# Altium schematic sheet STLink_Schematic.SchDoc
size A3; DocumentNumber: 1; Revision: V1.0; SheetNumber: 1; SheetTotal: 1
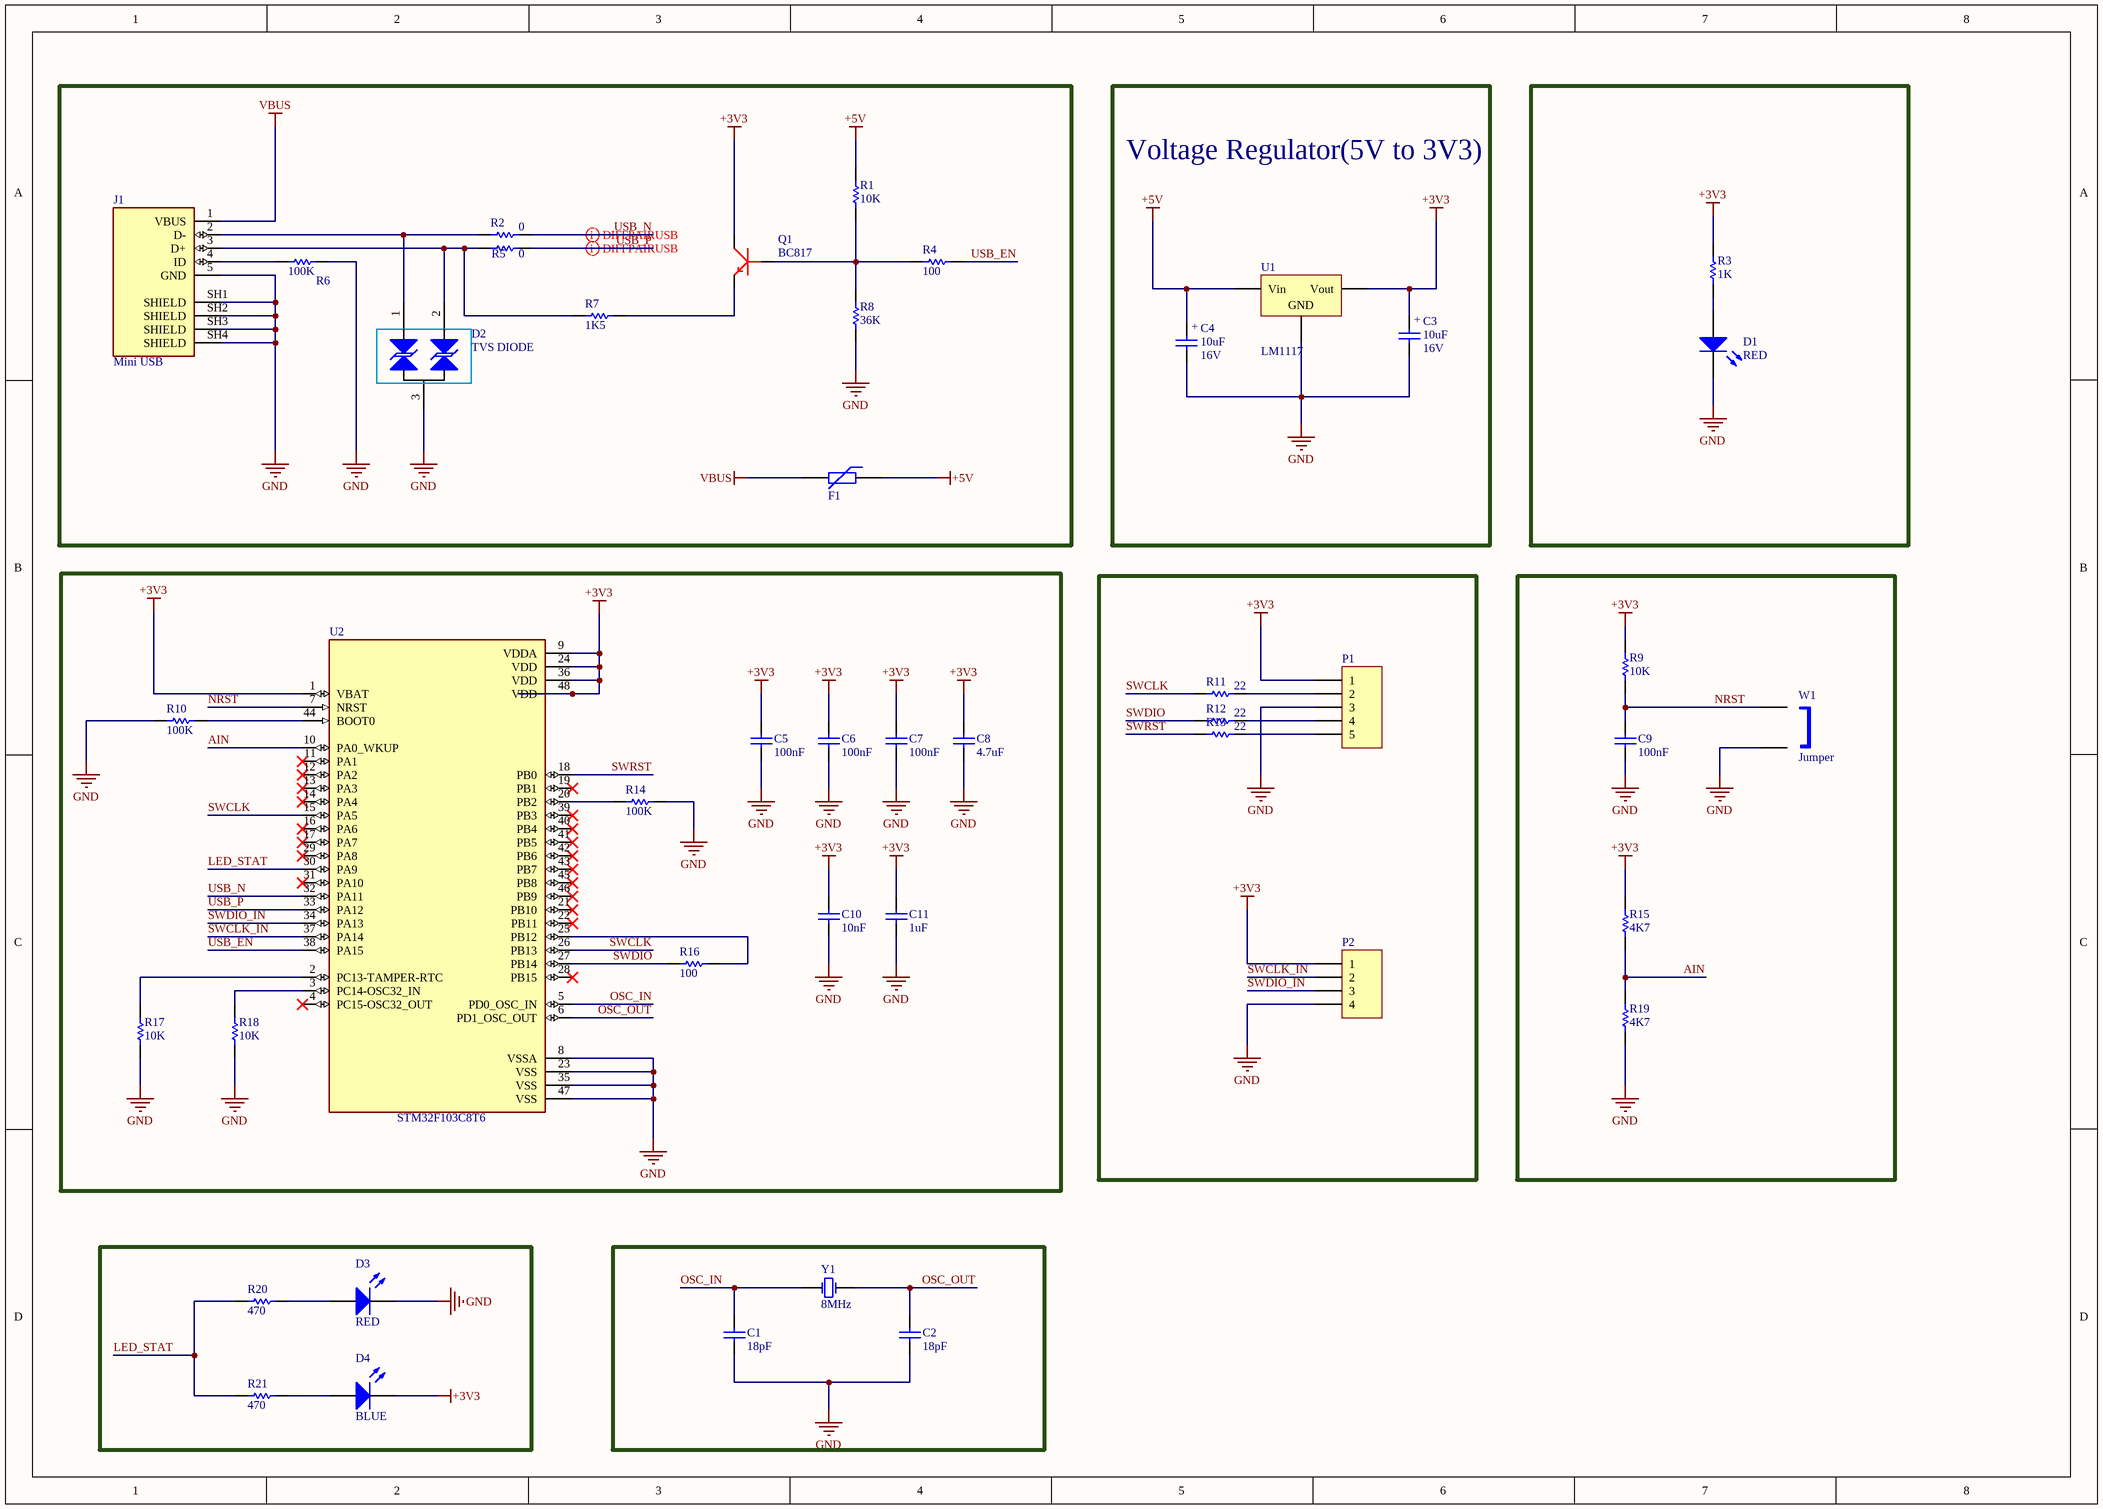
[diagram p0: STLink_Schematic.SchDoc]

## Parts
C1  18pF  [C805]
C2  18pF  [C805]
C3  Volte: 16V  [MY_SMC_B]  (hidden comment: 10uF)
C4  Volte: 16V  [MY_SMC_B]  (hidden comment: 10uF)
C5  100nF  [C805]
C6  100nF  [C805]
C7  100nF  [C805]
C8  4.7uF  [C805]
C9  100nF  [C805]
C10  10nF  [C805]
C11  1uF  [C805]
D1  RED  [MY_LED_1206]
D2  TVS DIODE  [SOT-23]
D3  RED  [MY_LED_0805]
D4  BLUE  [MY_LED_0805]
F1  (no value)  [PTC-0805]
J1  Mini USB  [MiniUSB]
P1  Header 5  [My_1X05]  (value not drawn)
P2  Header 4  [My_1X04]  (value not drawn)
Q1  BC817  [SOT23_3]
R1  10K  [R805]
R2  0  [R805]
R3  1K  [R805]
R4  100  [R805]
R5  0  [R805]
R6  100K  [R805]
R7  1K5  [R805]
R8  36K  [R805]
R9  10K  [R805]
R10  100K  [R805]
R11  22  [R805]
R12  22  [R805]
R13  22  [R805]
R14  100K  [R805]
R15  4K7  [R805]
R16  100  [R805]
R17  10K  [R805]
R18  10K  [R805]
R19  4K7  [R805]
R20  470  [R805]
R21  470  [R805]
U1  LM1117  [MY_SOT223]
U2  STM32F103C8T6  [QFP50P900X900X160-48N]
W1  Jumper  [My_1X02]
Y1  8MHz  [XTAL-SMD]

## Blocks framed on the sheet
Voltage Regulator(5V to 3V3): C3 C4 U1

## Nets
+3V3: C3.+ C5.2 C6.2 C7.2 C8.2 C10.2 C11.2 D4.K P1.1 P2.1 Q1.3(C) R3.2 R9.1 R15.1 U1.2(Vout) U2.1(VBAT) U2.9(VDDA) U2.24(VDD) U2.36(VDD) U2.48(VDD)
+5V: C4.+ F1.1 R1.2 U1.3(Vin)
GND: C1.1 C2.1 C3.- C4.- C5.1 C6.1 C7.1 C8.1 C9.1 C10.1 C11.1 D1.K D2.3(A) D3.K J1.5(GND) J1.SH1(SHIELD) J1.SH2(SHIELD) J1.SH3(SHIELD) J1.SH4(SHIELD) P1.3 P2.4 R6.2 R8.1 R10.2 R14.1 R17.2 R18.2 R19.2 U1.1(GND) U2.8(VSSA) U2.23(VSS) U2.35(VSS) U2.47(VSS) W1.2
VBUS: F1.2 J1.1(VBUS)
AIN: R15.2 R19.1 U2.10(PA0_WKUP)
LED_STAT: R20.2 R21.2 U2.30(PA9)
NRST: C9.2 R9.2 U2.7(NRST) W1.1
OSC_IN: C1.2 U2.5(PD0_OSC_IN) Y1.1(OSC1)
OSC_OUT: C2.2 U2.6(PD1_OSC_OUT) Y1.2(OSC2)
SWCLK: R11.2 U2.15(PA5) U2.26(PB13)
SWCLK_IN: P2.2 U2.37(PA14)
SWDIO: R12.2 R16.2 U2.27(PB14)
SWDIO_IN: P2.3 U2.34(PA13)
SWRST: R13.2 U2.18(PB0)
USB_EN: R4.1 U2.38(PA15)
USB_N: R2.2 U2.32(PA11)
USB_P: R5.2 U2.33(PA12)
NetD1_A: D1.A R3.1
NetD2_1: D2.1(K) J1.2(D-) R2.1
NetD2_2: D2.2(K) J1.3(D+) R5.1 R7.1
NetD3_A: D3.A R20.1
NetD4_A: D4.A R21.1
NetJ1_4: J1.4(ID) R6.1
NetP1_2: P1.2 R11.1
NetP1_4: P1.4 R12.1
NetP1_5: P1.5 R13.1
NetQ1_1: Q1.1(B) R1.1 R4.2 R8.2
NetQ1_2: Q1.2(E) R7.2
NetR10_1: R10.1 U2.44(BOOT0)
NetR14_2: R14.2 U2.20(PB2)
NetR16_1: R16.1 U2.25(PB12)
NetR17_1: R17.1 U2.2(PC13-TAMPER-RTC)
NetR18_1: R18.1 U2.3(PC14-OSC32_IN)

Not connected (* = marked no-connect by the designer): U2 4(PC15-OSC32_OUT)* 11(PA1)* 12(PA2)* 13(PA3)* 14(PA4)* 16(PA6)* 17(PA7)* 19(PB1)* 21(PB10)* 22(PB11)* 28(PB15)* 29(PA8)* 31(PA10)* 39(PB3)* 40(PB4)* 41(PB5)* 42(PB6)* 43(PB7)* 45(PB8)* 46(PB9)*

## Layout directives
differential pair; differential pair class DiffPairUSB: USB_N, USB_P

## Library data of the parts
C1 C2 C5-C11 = Cap: Capacitor; Designer: Parsa Malekpour
  C1 C2: Value: 18pF
  C5-C7 C9: Value: 100nF
  C8: Value: 4.7uF
  C10: Value: 10nF
  C11: Value: 1uF
C3 C4 = Cap Pol: Polar capacitor; ASiD Part Number: C-AS; Value: 10uF
D1 D3 D4 = LED: Typical INFRARED GaAs LED; ASiD Part Number: LED-AS
D2 = SM712
F1 = PTC: Published: 24-Mar-1999; PackageVersion: Mar-2003; PackageReference: 6-0805
J1 = Mini USB: MINI USB 2.0- B Type Receptacle conn. Right Angle Surface Mount Type; MF: Amphenol ICC; MP: 10033526-N3212LF; SnapEDA_Link: https://www.snapeda.com/parts/10033526-N3212LF/Amphenol+FCI/view-part/?ref=snap; Package: None; Value: *; Check_prices: https://www.snapeda.com/parts/10033526-N3212LF/Amphenol+FCI/view-part/?ref=eda
P1 = Header 5: Header, 5-Pin; ASiD Part Number: Header 5-AS
P2 = Header 4: Header, 4-Pin; ASiD Part Number: Header 4-AS
Q1 = bc817-16
R1-R21 = Resistor: Designer: Parsa Malekpour
  R1 R9 R17 R18: Value: 10K
  R2 R5: Value: 0
  R3: Value: 1K
  R4 R16: Value: 100
  R6 R10 R14: Value: 100K
  R7: Value: 1K5
  R8: Value: 36K
  R11-R13: Value: 22
  R15 R19: Value: 4K7
  R20 R21: Value: 470
U1 = LM1117: Low Drop Voltage Reg; ASiD Part Number: LM1117-AS
U2 = STM32F103C8T6: ARM® Cortex®-M3 STM32F1 Microcontroller IC 32-Bit 72MHz 64KB (64K x 8) FLASH 48-LQFP (7x7); MF: STMicroelectronics; SnapEDA_Link: https://www.snapeda.com/parts/STM32F103C8T6/STMicroelectronics/view-part/?ref=snap; Package: LQFP-48 STMicroelectronics; Value: *; MP: STM32F103C8T6; Check_prices: https://www.snapeda.com/parts/STM32F103C8T6/STMicroelectronics/view-part/?ref=eda
W1 = Jumper: Jumper Wire; ASiD Part Number: Jumper-AS
Y1 = XTAL: Crystal Oscillator; Designer: Parsa Malekpour; Email: Malekpour.parsa@Gmail.com; Value: 8MHz